# Altium project LKS_EVB_MVPOWPRE_V5.0.PrjPCB
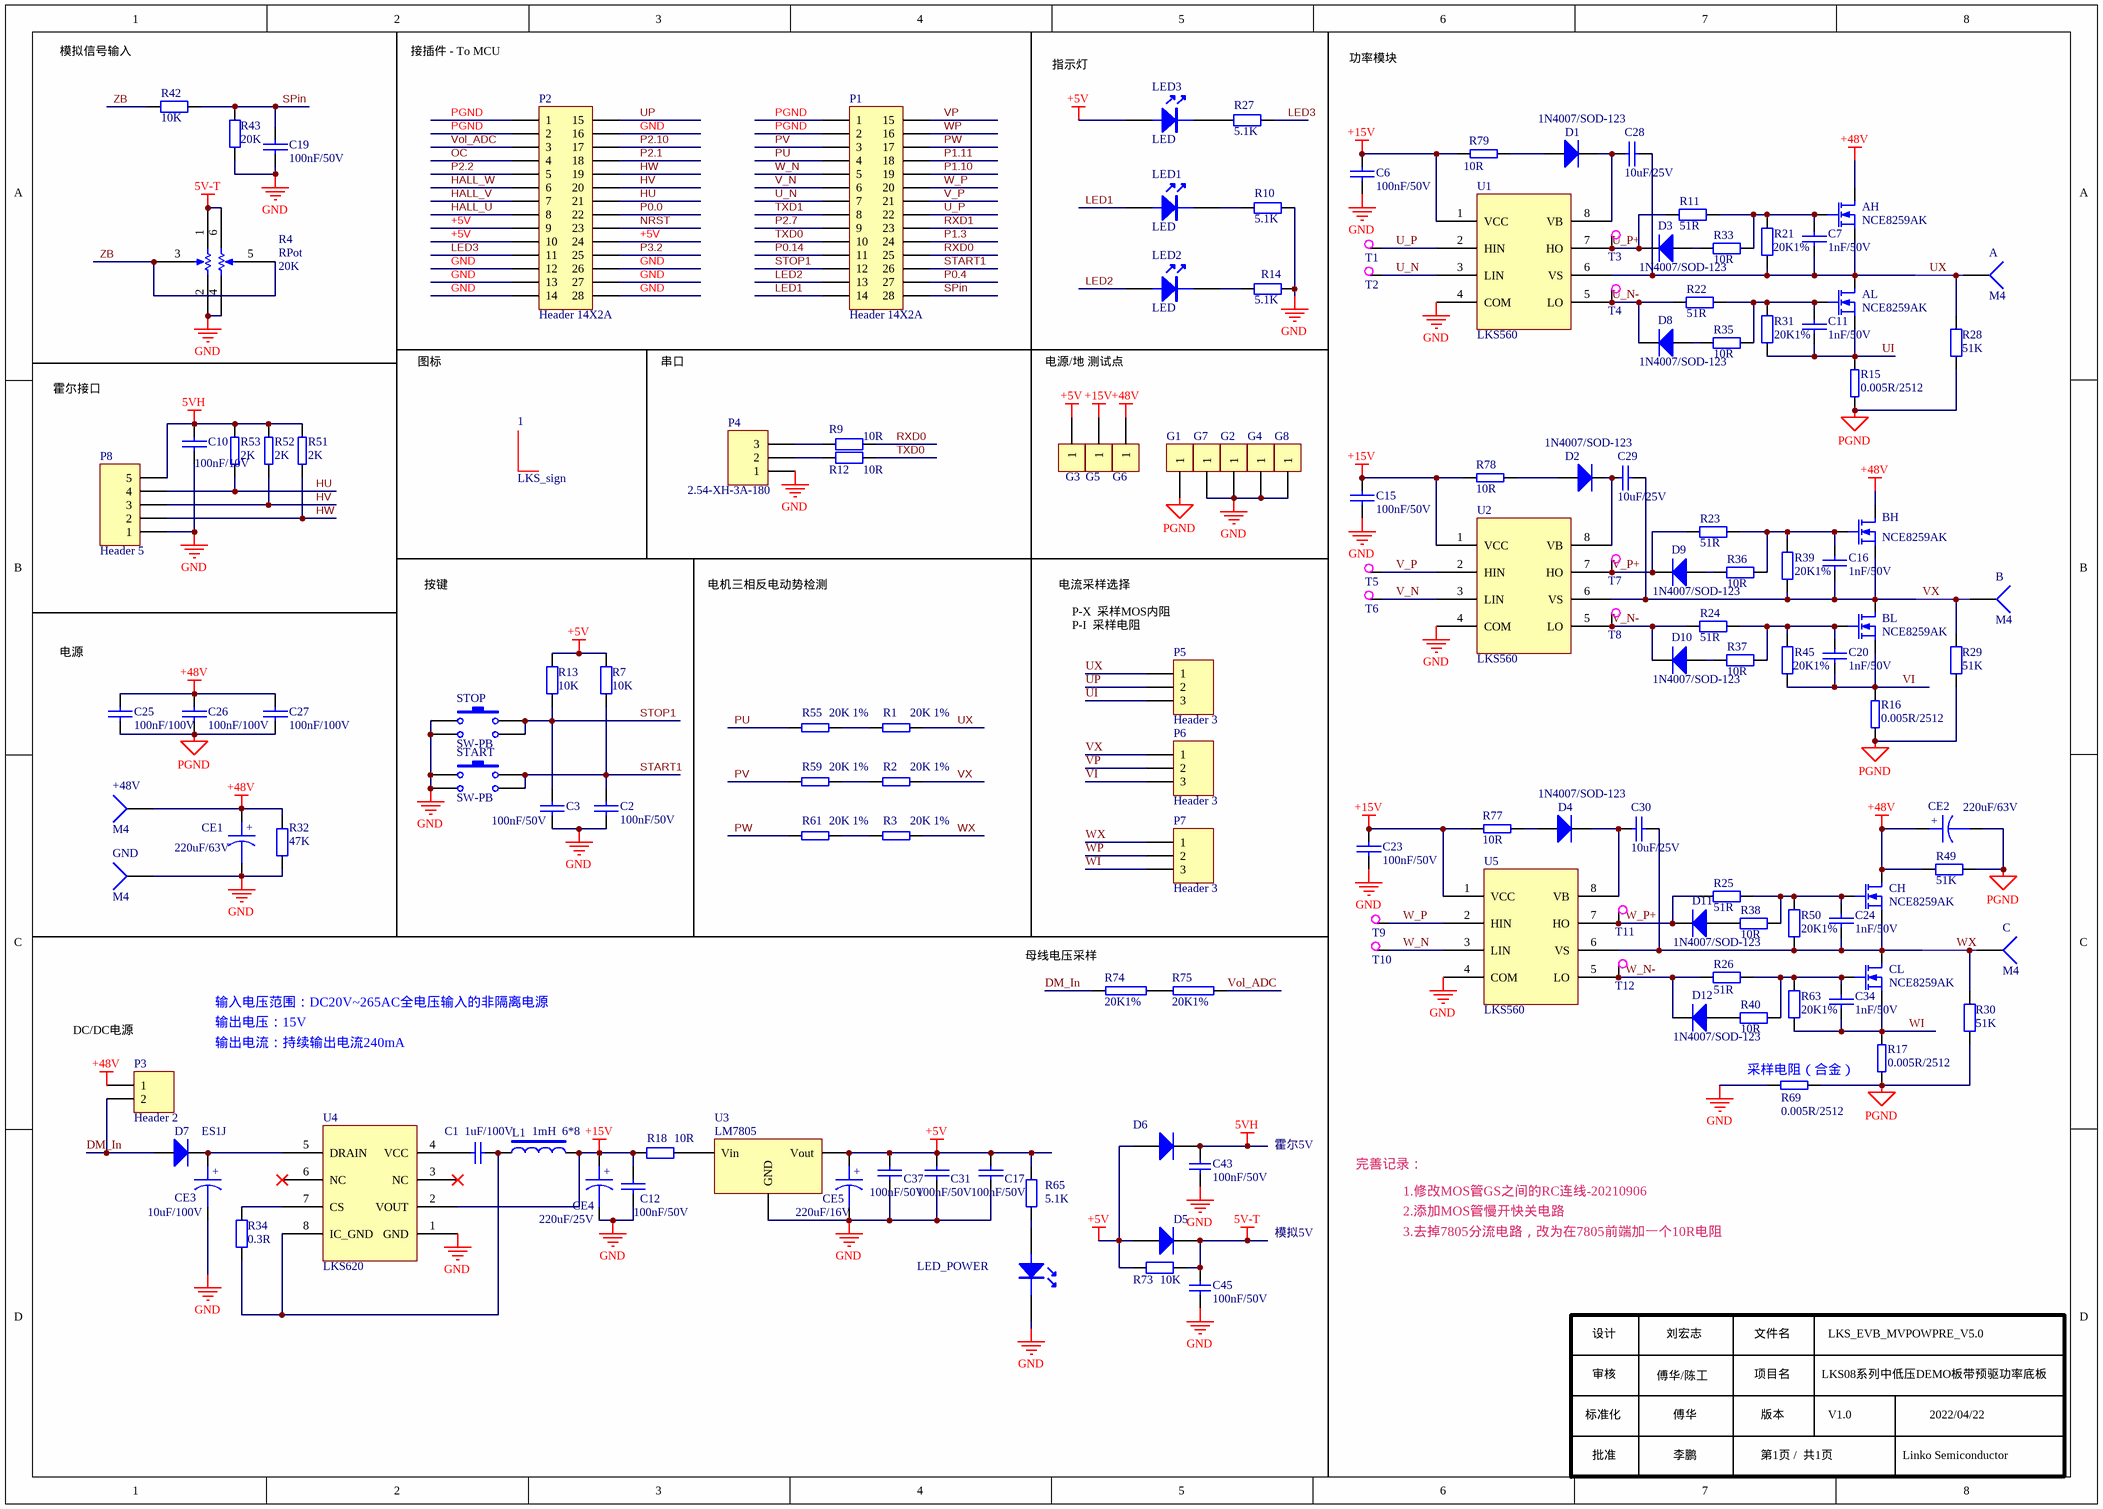
[diagram p0: LKS_EVB_MVPOWPRE_V5.0.SchDoc]
1 sheet, 150 parts. Net scope: global (net labels, ports and power ports of the same name join across sheets).
Board file: LKS_EVB_MVPOWPRE_V5.0.PcbDoc

## Sheet LKS_EVB_MVPOWPRE_V5.0.SchDoc: LKS_DEMO_V4.0
size A3; Author: LKS_LHZ

### Parts
1  LKS_sign  [LKS_LOGO2]
+48V  M4  [M4_CONECTOR]
A  M4  [M4_Conector]
AH  NCE8259AK  [TO-252]
AL  NCE8259AK  [TO-252]
B  M4  [M4_Conector]
BH  NCE8259AK  [TO-252]
BL  NCE8259AK  [TO-252]
C  M4  [M4_Conector]
C1  1uF/100V  [1206]
C2  100nF/50V  [0603C]
C3  100nF/50V  [0603C]
C6  100nF/50V  [0603C]
C7  1nF/50V  [0603C]
C10  100nF/10V  [0603C]
C11  1nF/50V  [0603C]
C12  100nF/50V  [0603C]
C15  100nF/50V  [0603C]
C16  1nF/50V  [0603C]
C17  100nF/50V  [0603C]
C19  100nF/50V  [0603C]
C20  1nF/50V  [0603C]
C23  100nF/50V  [0603C]
C24  1nF/50V  [0603C]
C25  100nF/100V  [0805C]
C26  100nF/100V  [0805C]
C27  100nF/100V  [0805C]
C28  10uF/25V  [1206C]
C29  10uF/25V  [1206C]
C30  10uF/25V  [1206C]
C31  100nF/50V  [0603C]
C34  1nF/50V  [0603C]
C37  100nF/50V  [0603C]
C43  100nF/50V  [0603C]
C45  100nF/50V  [0603C]
CE1  220uF/63V  [220UF/63V 12.5*12.5]
CE2  220uF/63V  [220UF/63V 12.5*12.5]
CE3  10uF/100V  [220UF/25V 8*10]
CE4  220uF/25V  [220UF/25V 8*10]
CE5  220uF/16V  [220UF/25V 8*10]
CH  NCE8259AK  [TO-252]
CL  NCE8259AK  [TO-252]
D1  1N4007/SOD-123  [SOD123]
D2  1N4007/SOD-123  [SOD123]
D3  1N4007/SOD-123  [SOD123]
D4  1N4007/SOD-123  [SOD123]
D5  1N4007  [D1206]  (value not drawn)
D6  1N4007  [D1206]  (value not drawn)
D7  ES1J  [DO-214AC]
D8  1N4007/SOD-123  [SOD123]
D9  1N4007/SOD-123  [SOD123]
D10  1N4007/SOD-123  [SOD123]
D11  1N4007/SOD-123  [SOD123]
D12  1N4007/SOD-123  [SOD123]
G1  PAD1.2  [PAD1.2]  (value not drawn)
G2  PAD1.2  [PAD1.2]  (value not drawn)
G3  PAD1.2  [PAD1.2]  (value not drawn)
G4  PAD1.2  [PAD1.2]  (value not drawn)
G5  PAD1.2  [PAD1.2]  (value not drawn)
G6  PAD1.2  [PAD1.2]  (value not drawn)
G7  PAD1.2  [PAD1.2]  (value not drawn)
G8  PAD1.2  [PAD1.2]  (value not drawn)
GND  M4  [M4_CONECTOR]
L1  1mH  6*8  [L_DIP_6*8MM]
LED1  LED  [SOD323]
LED2  LED  [SOD323]
LED3  LED  [SOD323]
LED_POWER  LED_R  [SOD323]  (value not drawn)
P1  Header 14X2A  [HDR2X14_CEN]
P2  Header 14X2A  [HDR2X14_CEN]
P3  Header 2  [HDR1X2]
P4  2.54-XH-3A-180  [2.54-XH-3A-180]
P5  Header 3  [HDR1X3]
P6  Header 3  [HDR1X3]
P7  Header 3  [HDR1X3]
P8  Header 5  [2.54-XH-5A-180]
R1  20K 1%  [0805R]
R2  20K 1%  [0805R]
R3  20K 1%  [0805R]
R4  RPot  value 20K  [RK097-W-1]
R7  10K  [0603R]
R9  10R  [0603R]
R10  5.1K  [0603R]
R11  51R  [0805R]
R12  10R  [0603R]
R13  10K  [0603R]
R14  5.1K  [0603R]
R15  0.005R/2512  [2512]
R16  0.005R/2512  [2512]
R17  0.005R/2512  [2512]
R18  10R  [1206R]
R21  20K1%  [0603R]
R22  51R  [0805R]
R23  51R  [0805R]
R24  51R  [0805R]
R25  51R  [0805R]
R26  51R  [0805R]
R27  5.1K  [0603R]
R28  51K  [0805R]
R29  51K  [0805R]
R30  51K  [0805R]
R31  20K1%  [0603R]
R32  47K  [1206R]
R33  10R  [0805R]
R34  0.3R  [1206]
R35  10R  [0805R]
R36  10R  [0805R]
R37  10R  [0805R]
R38  10R  [0805R]
R39  20K1%  [0603R]
R40  10R  [0805R]
R42  10K  [0603R]
R43  20K  [0603R]
R45  20K1%  [0603R]
R49  51K  [0805R]
R50  20K1%  [0603R]
R51  2K  [0805R]
R52  2K  [0805R]
R53  2K  [0805R]
R55  20K 1%  [0805R]
R59  20K 1%  [0805R]
R61  20K 1%  [0805R]
R63  20K1%  [0603R]
R65  5.1K  [0603R]
R69  0.005R/2512  [2512]
R73  10K  [0603R]
R74  20K1%  [0603R]
R75  20K1%  [0603R]
R77  10R  [0805r]
R78  10R  [0805r]
R79  10R  [0805r]
START  SW-PB  [SW-PB  12*12]
STOP  SW-PB  [SW-PB  12*12]
T1  TestP  [TP-80]  (value not drawn)
T2  TestP  [TP-80]  (value not drawn)
T3  TestP  [TP-80]  (value not drawn)
T4  TestP  [TP-80]  (value not drawn)
T5  TestP  [TP-80]  (value not drawn)
T6  TestP  [TP-80]  (value not drawn)
T7  TestP  [TP-80]  (value not drawn)
T8  TestP  [TP-80]  (value not drawn)
T9  TestP  [TP-80]  (value not drawn)
T10  TestP  [TP-80]  (value not drawn)
T11  TestP  [TP-80]  (value not drawn)
T12  TestP  [TP-80]  (value not drawn)
U1  LKS560  [SO-8]
U2  LKS560  [SO-8]
U3  LM7805  [SOT-89]
U4  LKS620  [SO-8]
U5  LKS560  [SO-8]

### Nets
5V-T: C45.2 D5.2(K) R4.1(TOP) R4.6(TOP) R73.2
5VH: C10.1 C43.2 D6.2(K) P8.5 R51.2 R52.2 R53.2
+5V: C17.2 C31.2 C37.2 CE5.1 D5.1(A) D6.1(A) G3.1 LED3.1(A) P2.9 P2.10 P2.24 R7.1 R13.2 R65.1 R73.1 U3.1(Vout)
+15V: C6.2 C12.1 C15.2 C23.2 CE4.1 G5.1 L1.1 R18.1 R77.1 R78.1 R79.1 U1.1(VCC) U2.1(VCC) U4.2(VOUT) U5.1(VCC)
+48V: +48V.1 AH.2(D) BH.2(D) C25.2 C26.2 C27.2 CE1.1 CE2.1 CH.2(D) G6.1 P3.1 R32.1 R49.1
GND: C2.1 C3.2 C6.1 C10.2 C12.2 C15.1 C17.1 C19.1 C23.1 C31.1 C37.1 C43.1 C45.1 CE1.2 CE3.2 CE4.2 CE5.2 G2.1 G4.1 G7.1 G8.1 GND.1 LED_POWER.2(K) P2.12 P2.13 P2.14 P2.16 P2.26 P2.27 P2.28 P4.1 P8.1 R4.2(TAP) R4.4(BOT) R10.2 R14.2 R32.2 R43.1 R69.2 START.1 START.3 STOP.1 STOP.3 U1.4(COM) U2.4(COM) U3.2(GND) U4.1(GND) U5.4(COM)
PGND: C25.1 C26.1 C27.1 CE2.2 G1.1 P1.1 P1.2 P2.1 P2.2 R15.2 R16.1 R17.2 R28.1 R29.1 R30.1 R49.2 R69.1
DM_In: D7.1(A) P3.2 R74.1
HALL_U: P2.8
HALL_V: P2.7
HALL_W: P2.6
HU: P2.21 P8.4 R53.1
HV: P2.20 P8.3 R52.1
HW: P2.19 P8.2 R51.1
LED1: LED1.1(A) P1.14
LED2: LED2.1(A) P1.13
LED3: P2.11 R27.2
NRST: P2.23
OC: P2.4
P0.0: P2.22
P0.4: P1.27
P0.14: P1.11
P1.3: P1.24
P1.10: P1.19
P1.11: P1.18
P2.1: P2.18
P2.2: P2.5
P2.7: P1.9
P2.10: P2.17
P3.2: P2.25
PU: P1.4 R55.1
PV: P1.3 R59.1
PW: P1.17 R61.1
RXD0: P1.25 R9.1
RXD1: P1.23
SPin: C19.2 P1.28 R42.2 R43.2
START1: C2.2 P1.26 R7.2 START.2 START.4
STOP1: C3.1 P1.12 R13.1 STOP.2 STOP.4
TXD0: P1.10 R12.2
TXD1: P1.8
U_N: P1.7 T2.1 U1.3(LIN)
U_N-: D8.2(K) R22.2 T4.1 U1.5(LO)
U_P: P1.22 T1.1 U1.2(HIN)
U_P+: D3.2(K) R11.1 T3.1 U1.7(HO)
UI: AL.3(S) C11.2 P5.3 R15.1 R31.1
UP: P2.15 P5.2
UX: A.1 AH.3(S) AL.2(D) C7.2 C28.2 P5.1 R1.2 R21.1 R28.2 U1.6(VS)
V_N: P1.6 T6.1 U2.3(LIN)
V_N-: D10.2(K) R24.2 T8.1 U2.5(LO)
V_P: P1.21 T5.1 U2.2(HIN)
V_P+: D9.2(K) R23.1 T7.1 U2.7(HO)
VI: BL.3(S) C20.2 P6.3 R16.2 R45.1
Vol_ADC: P2.3 R75.2
VP: P1.15 P6.2
VX: B.1 BH.3(S) BL.2(D) C16.2 C29.2 P6.1 R2.2 R29.2 R39.1 U2.6(VS)
W_N: P1.5 T10.1 U5.3(LIN)
W_N-: D12.2(K) R26.2 T12.1 U5.5(LO)
W_P: P1.20 T9.1 U5.2(HIN)
W_P+: D11.2(K) R25.1 T11.1 U5.7(HO)
WI: C34.2 CL.3(S) P7.3 R17.1 R63.1
WP: P1.16 P7.2
WX: C.1 C24.2 C30.2 CH.3(S) CL.2(D) P7.1 R3.2 R30.2 R50.1 U5.6(VS)
ZB: R4.3(BOT) R4.5(TAP) R42.1
NetAH_1: AH.1(G) C7.1 R11.2 R21.2 R33.2
NetAL_1: AL.1(G) C11.1 R22.1 R31.2 R35.2
NetBH_1: BH.1(G) C16.1 R23.2 R36.2 R39.2
NetBL_1: BL.1(G) C20.1 R24.1 R37.2 R45.2
NetC1_1: C1.1 U4.4(VCC)
NetC1_2: C1.2 L1.2 R34.2 U4.8(IC_GND)
NetC24_1: C24.1 CH.1(G) R25.2 R38.2 R50.2
NetC28_1: C28.1 D1.2(K) U1.8(VB)
NetC29_1: C29.1 D2.2(K) U2.8(VB)
NetC30_1: C30.1 D4.2(K) U5.8(VB)
NetC34_1: C34.1 CL.1(G) R26.1 R40.2 R63.2
NetCE3_1: CE3.1 D7.2(K) U4.5(DRAIN)
NetD1_1: D1.1(A) R79.2
NetD2_1: D2.1(A) R78.2
NetD3_1: D3.1(A) R33.1
NetD4_1: D4.1(A) R77.2
NetD8_1: D8.1(A) R35.1
NetD9_1: D9.1(A) R36.1
NetD10_1: D10.1(A) R37.1
NetD11_1: D11.1(A) R38.1
NetD12_1: D12.1(A) R40.1
NetLED1_2: LED1.2(K) R10.1
NetLED2_2: LED2.2(K) R14.1
NetLED3_2: LED3.2(K) R27.1
NetLED_POWER_1: LED_POWER.1(A) R65.2
NetP4_2: P4.2 R12.1
NetP4_3: P4.3 R9.2
NetR1_1: R1.1 R55.2
NetR2_1: R2.1 R59.2
NetR3_1: R3.1 R61.2
NetR18_2: R18.2 U3.3(Vin)
NetR34_1: R34.1 U4.7(CS)
NetR74_2: R74.2 R75.1

Not connected (* = marked no-connect by the designer): U4 3(NC)* 6(NC)*

### Notes on the sheet
- 模拟信号输入
- 接插件 - To MCU
- 指示灯
- 功率模块
- 图标
- 串口
- 电源/地 测试点
- 霍尔接口
- 按键
- 电机三相反电动势检测
- 电流采样选择
- P-X  采样MOS内阻
- P-I  采样电阻
- 电源
- (near R74) 母线电压采样
- (near P3) DC/DC电源
- 输入电压范围：DC20V~265AC全电压输入的非隔离电源
- 输出电压：15V
- 输出电流：持续输出电流240mA
- (near R69) 采样电阻（合金）
- 完善记录：
- 1.修改MOS管GS之间的RC连线-20210906
- 2.添加MOS管慢开快关电路
- 3.去掉7805分流电路，改为在7805前端加一个10R电阻
- 设计
- 审核
- 傅华/陈工
- 刘宏志
- 文件名
- 项目名
- LKS08系列中低压DEMO板带预驱功率底板
- LKS_EVB_MVPOWPRE_V5.0
- 标准化
- 批准
- 傅华
- 李鹏
- 版本
- 第1页 /  共1页
- V1.0
- Linko Semiconductor
- 2022/04/22
- Labels drawn without touching a wire or pin: 模拟5V, 霍尔5V
- (in symbol Capacitor Pol) +

### Library data of the parts
+48V A B C GND = Socket: LatestRevisionDate: 17-Jul-2002; LatestRevisionNote: Re-released for DXP Platform.; Publisher: Altium Limited
AH AL BH BL CH CL = MOS
C1 = Cap: Capacitor; Value: 10uF/100V; Published: 8-Jun-2000; LatestRevisionDate: 17-Jul-2002; LatestRevisionNote: Re-released for DXP Platform.; PackageReference: RAD-0.3; Publisher: Altium Limited; PackageDescription: Radial Cap, Thru-Hole; 2 Leads; 0.3 in Pin Spacing
C2 C3 C7 C10-C12 C16 C20 C24-C27 C34 = CAP: Capacitor
C6 C15 C17 C19 C23 C31 C37 = C: Capacitor
C28-C30 = Capacitor: Capacitor --贴片电容
C43 C45 = Cap: Capacitor; Value: 104; Published: 8-Jun-2000; LatestRevisionDate: 17-Jul-2002; LatestRevisionNote: Re-released for DXP Platform.; PackageReference: RAD-0.3; Publisher: Altium Limited; PackageDescription: Radial Cap, Thru-Hole; 2 Leads; 0.3 in Pin Spacing
CE1-CE5 = Capacitor Pol: Capacitor---电解电容
D1-D4 D7-D12 = Diode: Default Diode; Published: 8-Jun-2000; LatestRevisionDate: 17-Jul-2002; LatestRevisionNote: Re-released for DXP Platform.; PackageDocument: Sep-1996; PackageReference: SMC; Publisher: Altium Limited; Code_JEDEC: DO-214-AB
D5 D6 = Diode 1N4007: 1 Amp General Purpose Rectifier; Published: 8-Jun-2000; LatestRevisionDate: 17-Jul-2002; LatestRevisionNote: Re-released for DXP Platform.; DatasheetVersion: 1998; PackageVersion: Aug-1999; PackageReference: DO-41; Publisher: Altium Limited; PackageDescription: Diode, Axial; Body 5.2 x 2.7 mm (LxDia. max), Lead Dia. 0.86 mm (max); Code_JEDEC: DO-204-AL; ComponentLink1Description: Manufacturer Link; ComponentLink1URL: http://www.fairchildsemi.com/; ComponentLink2Description: Datasheet; ComponentLink2URL: http://www.fairchildsemi.com/ds/1N%2F1N4001.pdf
G1-G8 = CON1: Connector
L1 = L
LED_POWER = LED
P1 P2 = Header 14X2A: Header, 14-Pin, Dual row; LatestRevisionDate: 17-Jul-2002; LatestRevisionNote: Re-released for DXP Platform.; Publisher: Altium Limited
P3 = Header 2: Header, 2-Pin; LatestRevisionDate: 17-Jul-2002; LatestRevisionNote: Re-released for DXP Platform.; Publisher: Altium Limited
P4-P7 = Header 3: Header, 3-Pin; LatestRevisionDate: 17-Jul-2002; LatestRevisionNote: Re-released for DXP Platform.; Publisher: Altium Limited
P8 = Header 5: Header, 5-Pin; LatestRevisionDate: 17-Jul-2002; LatestRevisionNote: Re-released for DXP Platform.; Publisher: Altium Limited
R1-R3 R51-R53 R55 R59 R61 = RES/1
R4 = RPot: Potentiometer; Sim Note: Enter the Resistance value and the set point into parameter fields.; Set Position: 0.5; Published: 8-Jun-2000; LatestRevisionDate: 17-Jul-2002; LatestRevisionNote: Re-released for DXP Platform.; PackageReference: VR5; Publisher: Altium Limited; PackageDescription: Variable Resistor, Thru-Hole; 3 Leads
R7 R9 R13 R34 R73 = Res2: Resistor; Published: 8-Jun-2000; LatestRevisionDate: 17-Jul-2002; LatestRevisionNote: Re-released for DXP Platform.; Publisher: Altium Limited
  R7 R13: PackageReference: AXIAL-0.4; Value: 10K
  R9: PackageReference: 0603R
  R34: PackageReference: AXIAL-0.4; PackageDescription: Axial Device, Thru-Hole; 2 Leads; 0.4 in Pin Spacing; Value: 0.3R
  R73: PackageReference: AXIAL-0.4; PackageDescription: Axial Device, Thru-Hole; 2 Leads; 0.4 in Pin Spacing; Value: 10K
R10 R14 R27 = Res2: Resistor; Value: 10K; Published: 8-Jun-2000; LatestRevisionDate: 17-Jul-2002; LatestRevisionNote: Re-released for DXP Platform.; PackageReference: AXIAL-0.4; Publisher: Altium Limited
R11 R18 R21-R26 R31-R33 R39 R42 R43 R45 R50 R63 = Res: Resistor; Value: K; Published: 8-Jun-2000; LatestRevisionDate: 17-Jul-2002; LatestRevisionNote: Re-released for DXP Platform.; PackageReference: AXIAL-0.4; Publisher: Altium Limited; PackageDescription: Axial Device, Thru-Hole; 2 Leads; 0.4 in Pin Spacing
R12 = Res2: Resistor; Value: 100R; Published: 8-Jun-2000; LatestRevisionDate: 17-Jul-2002; LatestRevisionNote: Re-released for DXP Platform.; PackageReference: 0603R; Publisher: Altium Limited
R15-R17 R69 R77-R79 = RES2短
R28-R30 R35-R38 R40 R49 = 1Res: Resistor; Value: K; Published: 8-Jun-2000; LatestRevisionDate: 17-Jul-2002; LatestRevisionNote: Re-released for DXP Platform.; PackageReference: AXIAL-0.4; Publisher: Altium Limited; PackageDescription: Axial Device, Thru-Hole; 2 Leads; 0.4 in Pin Spacing
R65 = Res2: Resistor; Value: 510R; Published: 8-Jun-2000; LatestRevisionDate: 17-Jul-2002; LatestRevisionNote: Re-released for DXP Platform.; PackageReference: 0603R; Publisher: Altium Limited; PackageDescription: Axial Device, Thru-Hole; 2 Leads; 0.4 in Pin Spacing
R74 R75 = R
START STOP = SW-PB: Switch; Published: 24-Mar-1999; LatestRevisionDate: 17-Jul-2002; LatestRevisionNote: Re-released for DXP Platform.; PackageReference: SPST-2; Publisher: Altium Limited; PackageDescription: Switch; 2 Leads
U1 U2 U5 = IRS2003S
U3 = VOL-78